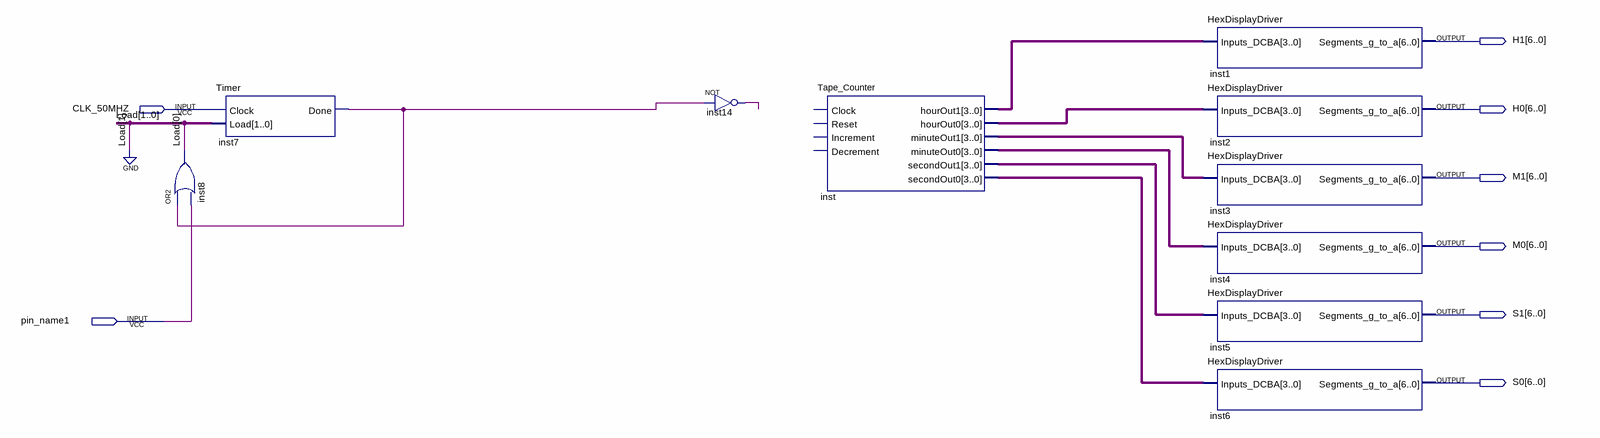
[diagram p0: schematic sheet]
// Quartus schematic tapeCounter.bdf as structural Verilog: 10 symbols, 8 pins
module tapeCounter (
  input  CLK_50MHZ,
  input  pin_name1,
  output [6:0] H1,
  output [6:0] H0,
  output [6:0] M1,
  output [6:0] M0,
  output [6:0] S1,
  output [6:0] S0
);

  wire inst7_done, inst14_out;
  wire [0:0] Load;
  wire [3:0] inst_hourout0, inst_hourout1, inst_minuteout0, inst_minuteout1, inst_secondout0, inst_secondout1;

  or inst8 (Load[0], inst7_done, pin_name1);
  Timer inst7 (.Clock(CLK_50MHZ), .Load({1'b0, Load[0]}), .Done(inst7_done));
  not inst14 (inst14_out, inst7_done);
  Tape_Counter inst (
    .hourOut1(inst_hourout1), .hourOut0(inst_hourout0), .minuteOut1(inst_minuteout1),
    .minuteOut0(inst_minuteout0), .secondOut1(inst_secondout1), .secondOut0(inst_secondout0));  // open: Clock, Reset, Increment, Decrement
  HexDisplayDriver inst1 (.Inputs_DCBA(inst_hourout1), .Segments_g_to_a(H1));
  HexDisplayDriver inst2 (.Inputs_DCBA(inst_hourout0), .Segments_g_to_a(H0));
  HexDisplayDriver inst3 (.Inputs_DCBA(inst_minuteout1), .Segments_g_to_a(M1));
  HexDisplayDriver inst4 (.Inputs_DCBA(inst_minuteout0), .Segments_g_to_a(M0));
  HexDisplayDriver inst5 (.Inputs_DCBA(inst_secondout1), .Segments_g_to_a(S1));
  HexDisplayDriver inst6 (.Inputs_DCBA(inst_secondout0), .Segments_g_to_a(S0));
endmodule
